# Altium schematic sheet H-Bridge.SchDoc: H-Bridge
size A4; SheetNumber: 3; SheetTotal: 4
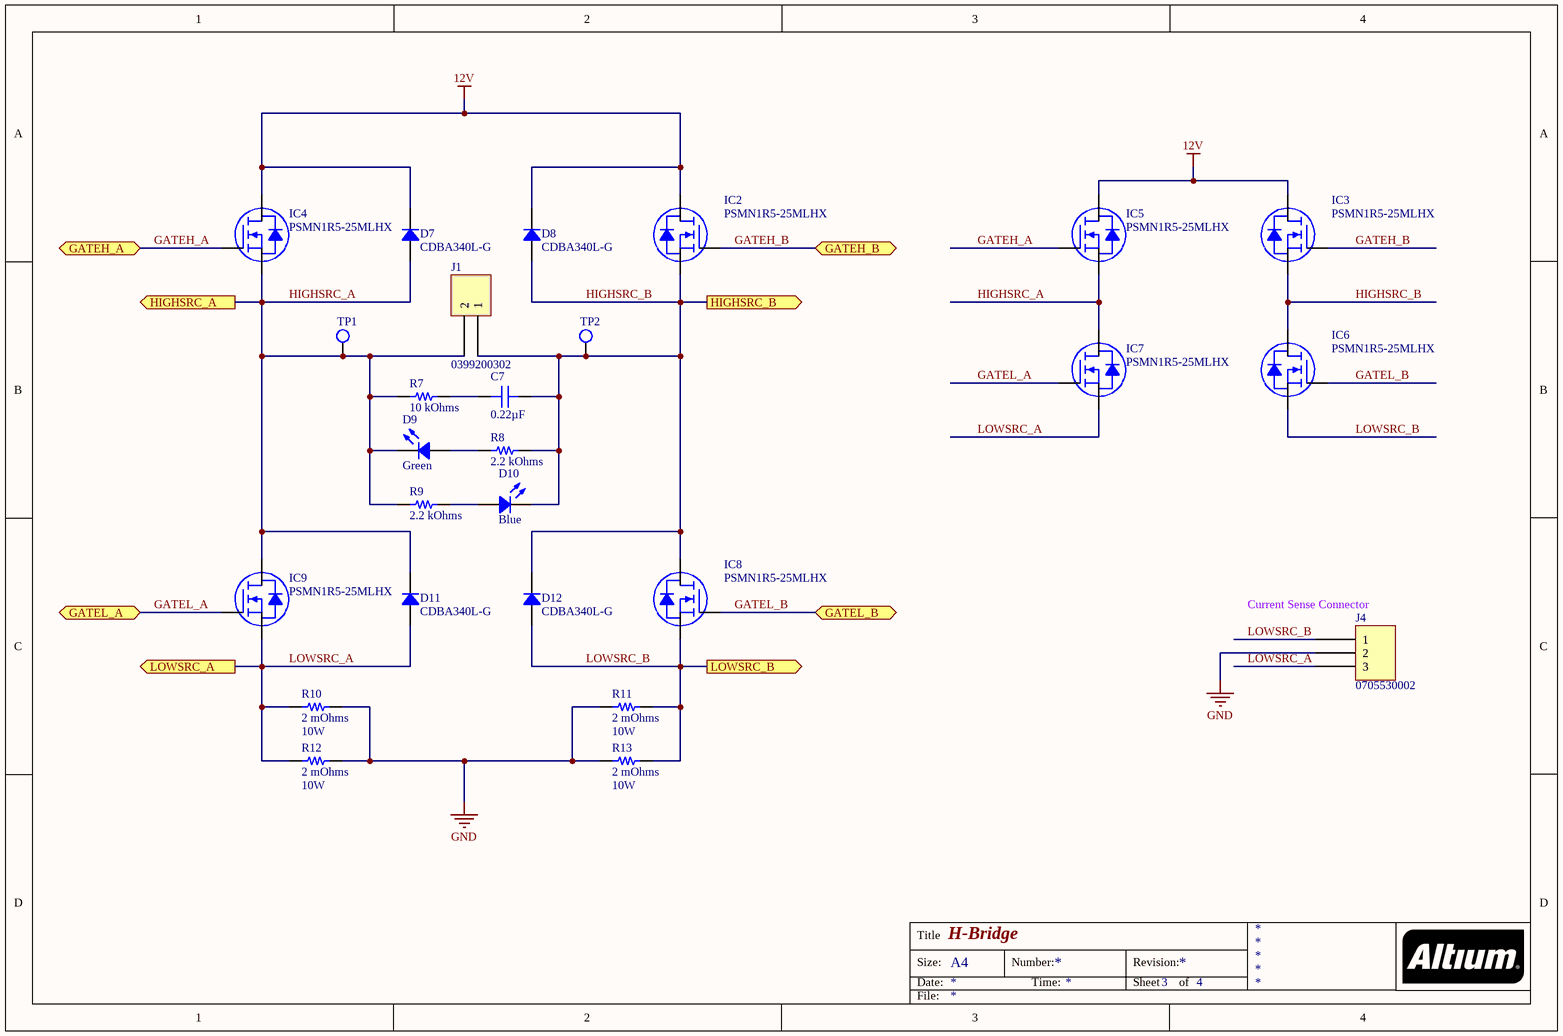
[diagram p0: H-Bridge.SchDoc]

## Parts
C7  0.22µF  [CAP 0805_2012]
D7  CDBA340L-G  [DO214AC SMA]
D8  CDBA340L-G  [DO214AC SMA]
D9  Green  [LED 0603_1608 GREEN]
D10  Blue  [LED 0603_1608 BLUE]
D11  CDBA340L-G  [DO214AC SMA]
D12  CDBA340L-G  [DO214AC SMA]
IC2  PSMN1R5-25MLHX  [NEXPERIA LFPAK33 SOT1210]
IC3  PSMN1R5-25MLHX  [NEXPERIA LFPAK33 SOT1210]
IC4  PSMN1R5-25MLHX  [NEXPERIA LFPAK33 SOT1210]
IC5  PSMN1R5-25MLHX  [NEXPERIA LFPAK33 SOT1210]
IC6  PSMN1R5-25MLHX  [NEXPERIA LFPAK33 SOT1210]
IC7  PSMN1R5-25MLHX  [NEXPERIA LFPAK33 SOT1210]
IC8  PSMN1R5-25MLHX  [NEXPERIA LFPAK33 SOT1210]
IC9  PSMN1R5-25MLHX  [NEXPERIA LFPAK33 SOT1210]
J1  0399200302  [MOLEX 0399200302]
J4  0705530002  [MOLEX SDA-70553-3PIN]
R7  10 kOhms  [RES 0805_2012]
R8  2.2 kOhms  [RES 0603_1608]
R9  2.2 kOhms  [RES 0603_1608]
R10  2 mOhms  Power (Watts): 10W  [VISHAY WSHP2818]
R11  2 mOhms  Power (Watts): 10W  [VISHAY WSHP2818]
R12  2 mOhms  Power (Watts): 10W  [VISHAY WSHP2818]
R13  2 mOhms  Power (Watts): 10W  [VISHAY WSHP2818]
TP1  Test Point  [TestPoint-1.5mm]  (value not drawn)  (no BOM)
TP2  Test Point  [TestPoint-1.5mm]  (value not drawn)  (no BOM)

## Ports
GATEH_A (bidir), GATEH_B (bidir), GATEL_A (bidir), GATEL_B (bidir), HIGHSRC_A (out), HIGHSRC_B (out), LOWSRC_A (out), LOWSRC_B (out)

## Nets
12V: D7.2 D8.2 IC2.D IC3.D IC4.D IC5.D
GND: J4.2 R10.2 R11.1 R12.2 R13.1
GATEH_A: IC4.G IC5.G ; port GATEH_A
GATEH_B: IC2.G IC3.G ; port GATEH_B
GATEL_A: IC7.G IC9.G ; port GATEL_A
GATEL_B: IC6.G IC8.G ; port GATEL_B
HIGHSRC_A: D7.1 D9.2 D11.2 IC4.S IC5.S IC7.D IC9.D J1.2 R7.1 R9.1 TP1.1(TP) ; port HIGHSRC_A
HIGHSRC_B: C7.2 D8.1 D10.2 D12.2 IC2.S IC3.S IC6.D IC8.D J1.1 R8.2 TP2.1(TP) ; port HIGHSRC_B
LOWSRC_A: D11.1 IC7.S IC9.S J4.3 R10.1 R12.1 ; port LOWSRC_A
LOWSRC_B: D12.1 IC6.S IC8.S J4.1 R11.2 R13.2 ; port LOWSRC_B
NetC7_1: C7.1 R7.2
NetD9_1: D9.1 R8.1
NetD10_1: D10.1 R9.2

## Notes on the sheet
- (near J4) Current Sense Connector
- Title
- Size:
- Date:
- A4
- Number:
- Time:
- Revision:
- Sheet
- of
- File:

## Library data of the parts
C7 = 08055C224KAZ2A: CAP CER 0.22UF 50V X7R 0805; manufacturer: AVX Corporation; Tolerance: ±10%; Part Number: 08055C224KAZ2A; Value: 0.22µF; Applications: Boardflex Sensitive; Capacitance: 0.22µF; componentlink1description: Datasheet; componentlink1url: http://datasheets.avx.com/FlexitermMLCC.pdf; componentlink2description: DigiKey Link; componentlink2url: http://digikey.com/product-detail/en/avx-corporation/08055C224KAZ2A/478-3555-1-ND/1024908; Device Package: 0805 (2012 Metric); Features: Soft Termination; lastupdated: 02/09/2020 01:04:11; Lifecycle Status: Active; Minimum Order: 1; Mounting Type: Surface Mount, MLCC; Operating Temperature: -55°C ~ 125°C; Package / Case: 0805 (2012 Metric); packaging: TapeAndReel; partid: 16770; Part Status: Active; price: 0.07; series: FLEXITERM®; Size / Dimension: 0.079" L x 0.049" W (2.01mm x 1.25mm); Supplier 1: DigiKey; Supplier Part Number 1: 478-3555-1-ND; Temperature Coefficient: X7R; Thickness (Max): 0.055" (1.40mm); Voltage - Rated: 50V
D7 D8 D11 D12 = CDBA340L-G: DIODE SCHOTTKY 40V 3A DO214AC; Manufacturer: Comchip Technology; Current - Reverse Leakage @ Vr: 1.5 mA @ 40 V; Speed: Fast Recovery =< 500ns, > 200mA (Io); Voltage - Forward (Vf) (Max) @ If: 400 mV @ 3 A; Part Number: CDBA340L-G; ComponentLink1Description: Datasheet; ComponentLink1URL: http://www.comchiptech.com/admin/files/product/CDBA340L-HF%20RevC514368.pdf; ComponentLink2Description: DigiKey Link; ComponentLink2URL: https://www.digikey.com/en/products/detail/comchip-technology/CDBA340L-G/1249117; Current - Average Rectified (Io): 3A; Diode Type: Schottky; LastUpdated: 04/03/2022 18:07:12; Lifecycle Status: Active; Minimum Order: 1; Mounting Type: Surface Mount; Operating Temperature - Junction: 125°C (Max); Package / Case: DO-214AC, SMA; Packaging: TapeAndReel; PartId: 2091; Part Status: Active; Price: 0.20; Series: -; Supplier 1: DigiKey; Supplier Part Number 1: 641-1258-1-ND; Supplier Device Package: DO-214AC (SMA); Voltage - DC Reverse (Vr) (Max): 40 V
D9 = XZMG53W-1: LED GREEN CLEAR CHIP SMD; Manufacturer: SunLED; Configuration: Standard; Current - Test: 20mA; Lens Color: Colorless; Lens Size: 1.10mm x 0.80mm; Lens Style: Rectangle with Flat Top; Millicandela Rating: 11mcd; Viewing Angle: 120°; Voltage - Forward (Vf) (Typ): 2.2V; Wavelength - Dominant: 568nm; Wavelength - Peak: 565nm; Part Number: XZMG53W-1; Color: Green; ComponentLink1Description: Datasheet; ComponentLink1URL: https://www.sunledusa.com/products/spec/XZMG53W-1.pdf; ComponentLink2Description: DigiKey Link; ComponentLink2URL: https://www.digikey.com/en/products/detail/sunled/XZMG53W-1/4745960; Device Package: 0603 (1608 Metric); Height (Max): 0.75mm; LastUpdated: 04/03/2022 18:10:12; Lens Transparency: Clear; Lifecycle Status: Active; Minimum Order: 1; Mounting Type: Surface Mount; Package / Case: 0603 (1608 Metric); Packaging: TapeAndReel; PartId: 678; Part Status: Active; Price: 0.04; Series: -; Size / Dimension: 1.60mm L x 0.80mm W; Supplier 1: DigiKey; Supplier Part Number 1: 1497-1186-1-ND; Supplier Device Package: Chip LED; Value: Green
D10 = 19-213SUBC/S400-A5/S208-2/TR8: LED BLUE CLEAR 2SMD; Manufacturer: Everlight Electronics Co Ltd; Configuration: Standard; Current - Test: 5mA; Lens Color: Colorless; Lens Size: 1.20mm x 0.80mm; Lens Style: Rectangle with Flat Top; Viewing Angle: 120°; Voltage - Forward (Vf) (Typ): 2.9V; Wavelength - Peak: 468nm; Part Number: 19-213SUBC/S400-A5/S208-2/TR8; Color: Blue; ComponentLink1Description: Datasheet; ComponentLink1URL: //media.digikey.com/pdf/Data%20Sheets/Everlight%20PDFs/19-213SUBC-S400-A5-S208-2-TR8.pdf; ComponentLink2Description: DigiKey Link; ComponentLink2URL: https://www.digikey.com/en/products/detail/everlight-electronics-co-ltd/19-213SUBC-S400-A5-S208-2-TR8/8535275; Device Package: 0603 (1608 Metric); Height (Max): 0.70mm; LastUpdated: 04/03/2022 18:09:56; Lens Transparency: Clear; Lifecycle Status: Active; Minimum Order: 1; Mounting Type: Surface Mount; Package / Case: 0603 (1608 Metric); Packaging: TapeAndReel; PartId: 808; Part Status: Active; Price: 0.04; Series: -; Size / Dimension: 1.60mm L x 0.80mm W; Supplier 1: DigiKey; Supplier Part Number 1: 1080-1581-1-ND; Supplier Device Package: 2-SMD; Value: Blue
IC2-IC9 = PSMN1R5-25MLHX: MOSFET N-CH 25V 150A LFPAK33; Manufacturer: Nexperia USA Inc.; Current - Continuous Drain (Id) @ 25°C: 150A (Ta); Drive Voltage (Max Rds On,  Min Rds On): 4.5V, 10V; FET Type: N-Channel; Gate Charge (Qg) (Max) @ Vgs: 58 nC @ 10 V; Input Capacitance (Ciss) (Max) @ Vds: 3167 pF @ 12 V; Power Dissipation (Max): 106W (Ta); Rds On (Max) @ Id, Vgs: 1.81mOhm @ 25A, 10V; Vgs (Max): ±20V; Vgs(th) (Max) @ Id: 2.2V @ 1mA; Part Number: PSMN1R5-25MLHX; ComponentLink1Description: Datasheet; ComponentLink1URL: https://assets.nexperia.com/documents/data-sheet/PSMN1R5-25MLH.pdf; ComponentLink2Description: DigiKey Link; ComponentLink2URL: https://www.digikey.com/en/products/detail/nexperia-usa-inc/PSMN1R5-25MLHX/11205917; Device Package: 1210 (3225 Metric); Drain to Source Voltage (Vdss): 25 V; LastUpdated: 05/03/2022 14:14:29; Lifecycle Status: Active; Minimum Order: 1; Mounting Type: Surface Mount; Operating Temperature: -55°C ~ 175°C (TJ); Package / Case: 1210 (3225 Metric); Packaging: TapeAndReel; Part Status: Active; Price: 0.82; Series: -; Supplier 1: DigiKey; Supplier Part Number 1: 1727-PSMN1R5-25MLHXCT-ND; Supplier Device Package: LFPAK33; Technology: MOSFET (Metal Oxide)
J1 = 0399200302: TERM BLK 2P SIDE ENTRY 15MM PCB; Manufacturer: Molex; Current: 115 A; Mating Orientation: Horizontal with Board; Number of Levels: 1; Pitch: 0.591" (15.00mm); Positions Per Level: 2; Voltage: 600 V; Wire Gauge: 1-8 AWG; Wire Termination: Screw - Rising Cage Clamp; Part Number: 0399200302; Color: Black; ComponentLink1Description: Datasheet; ComponentLink1URL: https://www.molex.com/pdm_docs/sd/399200302_sd.pdf; ComponentLink2Description: DigiKey Link; ComponentLink2URL: https://www.digikey.com/en/products/detail/molex/0399200302/3316297; LastUpdated: 05/03/2022 16:30:55; Lifecycle Status: Active; Minimum Order: 1; Mounting Type: Through Hole; Packaging: Bulk; Part Status: Active; Price: 5.90; Series: Eurostyle 39920; Supplier 1: DigiKey; Supplier Part Number 1: WM20114-ND
J4 = 0705530002: CONN HEADER R/A 3POS 2.54MM; Manufacturer: Molex; Contact Length - Mating: 0.240" (6.10mm); Contact Length - Post: 0.130" (3.30mm); Material Flammability Rating: UL94 V-0; Number of Positions: 3; Number of Positions Loaded: All; Pitch - Mating: 0.100" (2.54mm); Shrouding: Shrouded - 4 Wall; Style: Board to Cable/Wire; Voltage Rating: 250V; Part Number: 0705530002; ComponentLink1Description: Datasheet; ComponentLink1URL: https://www.molex.com/pdm_docs/sd/705530002_sd.pdf; ComponentLink2Description: DigiKey Link; ComponentLink2URL: http://digikey.com/product-detail/en/molex/0705530002/WM4901-ND/114955; Connector Type: Header; Contact Finish - Mating: Gold; Contact Finish - Post: Tin; Contact Finish Thickness - Mating: 15.0µin (0.38µm); Contact Material: Phosphor Bronze; Contact Shape: Square; Contact Type: Male Pin; Fastening Type: Latch Holder; Insulation Color: Black; Insulation Height: 0.215" (5.45mm); Insulation Material: Polyester, Glass Filled; LastUpdated: 12/01/2020 23:55:56; Lifecycle Status: Active; Minimum Order: 1; Mounting Type: Through Hole, Right Angle; Number of Rows: 1; Operating Temperature: -40°C ~ 105°C; Packaging: Tube; PartId: 86; Part Status: Active; Price: 1.02; Series: SL 70553; Supplier 1: DigiKey; Supplier Part Number 1: WM4901-ND; Termination: Solder
R7 = ERJ-P06J103V: RES SMD 10K OHM 5% 1/2W 0805; Manufacturer: Panasonic Electronic Components; Power (Watts): 0.5W, 1/2W; Temperature Coefficient: ±200ppm/°C; Part Number: ERJ-P06J103V; Value: 10 kOhms; ComponentLink1Description: Datasheet; ComponentLink1URL: https://industrial.panasonic.com/cdbs/www-data/pdf/RDO0000/AOA0000C331.pdf; ComponentLink2Description: DigiKey Link; ComponentLink2URL: https://www.digikey.com/en/products/detail/panasonic-electronic-components/ERJ-P06J103V/525198; Composition: Thick Film; Device Package: 0805 (2012 Metric); Features: Automotive AEC-Q200, Pulse Withstanding; Height - Seated (Max): 0.028" (0.70mm); LastUpdated: 04/03/2022 17:58:19; Lifecycle Status: Active; Minimum Order: 1; Number of Terminations: 2; Operating Temperature: -55°C ~ 155°C; Package / Case: 0805 (2012 Metric); Packaging: TapeAndReel; PartId: 48720; Part Status: Active; Price: 0.02; Ratings: AEC-Q200; Resistance: 10 kOhms; Series: ERJ-P06; Size / Dimension: 0.079" L x 0.049" W (2.00mm x 1.25mm); Supplier 1: DigiKey; Supplier Part Number 1: P10KADCT-ND; Supplier Device Package: 0805; Tolerance: ±5%
R8 R9 = ERJ-PA3J222V: RES SMD 2.2K OHM 5% 1/4W 0603; Manufacturer: Panasonic Electronic Components; Power (Watts): 0.25W, 1/4W; Temperature Coefficient: ±200ppm/°C; Part Number: ERJ-PA3J222V; Value: 2.2 kOhms; ComponentLink1Description: Datasheet; ComponentLink1URL: https://industrial.panasonic.com/cdbs/www-data/pdf/RDO0000/AOA0000C331.pdf; ComponentLink2Description: DigiKey Link; ComponentLink2URL: https://www.digikey.com/en/products/detail/panasonic-electronic-components/ERJ-PA3J222V/5036018; Composition: Thick Film; Device Package: 0603 (1608 Metric); Features: Automotive AEC-Q200, Pulse Withstanding; Height - Seated (Max): 0.022" (0.55mm); LastUpdated: 04/03/2022 17:46:44; Lifecycle Status: Active; Minimum Order: 1; Number of Terminations: 2; Operating Temperature: -55°C ~ 155°C; Package / Case: 0603 (1608 Metric); Packaging: TapeAndReel; PartId: 14127; Part Status: Active; Price: 0.01; Ratings: AEC-Q200; Resistance: 2.2 kOhms; Series: ERJ-PA3; Size / Dimension: 0.063" L x 0.031" W (1.60mm x 0.80mm); Supplier 1: DigiKey; Supplier Part Number 1: P2.2KBZCT-ND; Supplier Device Package: 0603; Tolerance: ±5%
R10-R13 = WSHP28182L000FEA: RES 0.002 OHM 1% 10W 2818; Manufacturer: Vishay Dale; Temperature Coefficient: ±200ppm/°C; Part Number: WSHP28182L000FEA; Package / Case: Nonstandard; ComponentLink1Description: Datasheet; ComponentLink1URL: http://www.vishay.com/docs/30347/wshp2818.pdf; ComponentLink2Description: DigiKey Link; ComponentLink2URL: http://digikey.com/product-detail/en/vishay-dale/WSHP28182L000FEA/541-3273-1-ND/6605249; Composition: Metal Element; Device Package: Nonstandard; Features: Automotive AEC-Q200, Current Sense, Moisture Resistant, Pulse Withstanding; Height - Seated (Max): 0.069" (1.75mm); LastUpdated: 04/03/2022 18:20:41; Lifecycle Status: Active; Minimum Order: 1; Number of Terminations: 2; Operating Temperature: -65°C ~ 170°C; Packaging: TapeAndReel; PartId: 2683; Part Status: Active; Price: 0.90; Ratings: AEC-Q200; Resistance: 2 mOhms; Series: WSHP2818; Size / Dimension: 0.280" L x 0.181" W (7.10mm x 4.60mm); Supplier 1: DigiKey; Supplier Part Number 1: 541-3273-1-ND; Supplier Device Package: 2818; Tolerance: ±1%; Value: 2 mOhms